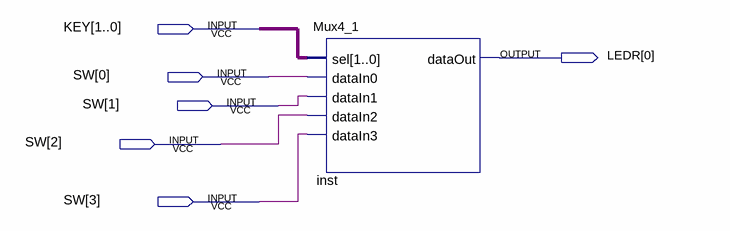
[diagram p0: schematic sheet]
// Quartus schematic Mux4_1Demo.bdf as structural Verilog: 1 symbols, 6 pins
module Mux4_1Demo (
  input  [1:0] KEY,
  input  [3:0] SW,
  output [0:0] LEDR
);

  Mux4_1 inst (.sel(KEY), .dataIn0(SW[0]), .dataIn1(SW[1]), .dataIn2(SW[2]), .dataIn3(SW[3]), .dataOut(LEDR[0]));
endmodule
